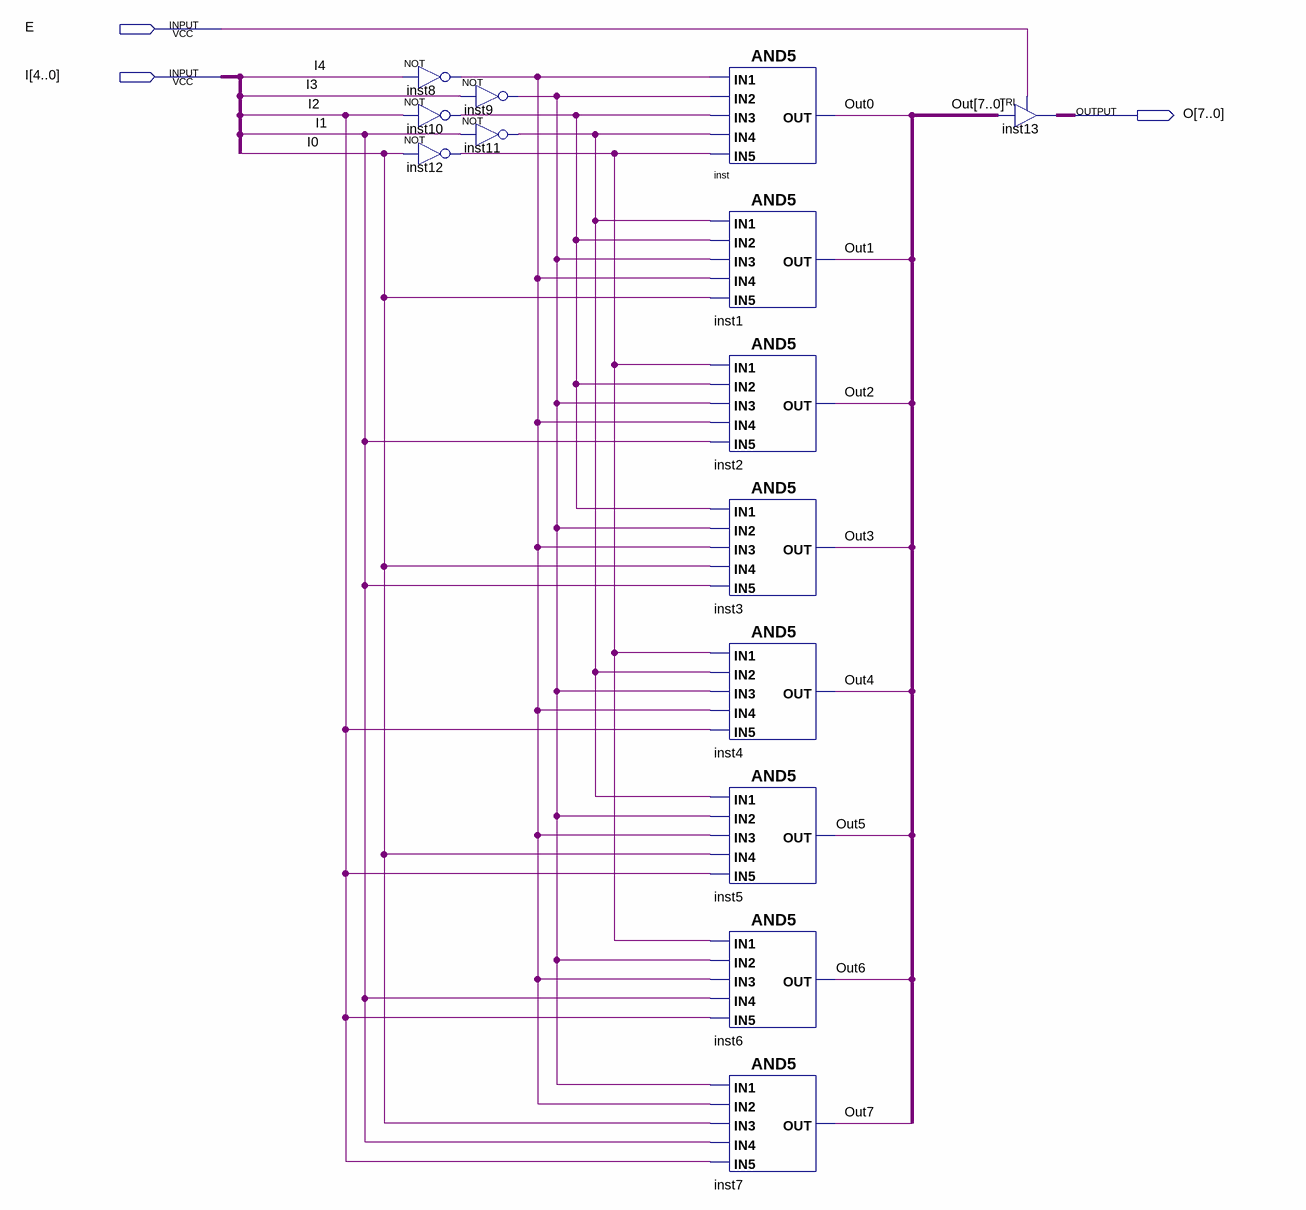
[diagram p0: schematic sheet]
// Quartus schematic decoder5to8.bdf as structural Verilog: 14 symbols, 3 pins
module decoder5to8 (
  input  E,
  input  [4:0] I,
  output [7:0] O
);

  wire inst8_out, inst9_out, inst10_out, inst11_out, inst12_out;
  wire [7:0] Out;

  not inst8 (inst8_out, I[4]);
  not inst10 (inst10_out, I[2]);
  not inst12 (inst12_out, I[0]);
  not inst9 (inst9_out, I[3]);
  not inst11 (inst11_out, I[1]);
  and inst (Out[0], inst8_out, inst9_out, inst10_out, inst11_out, inst12_out);
  and inst1 (Out[1], inst11_out, inst10_out, inst9_out, inst8_out, I[0]);
  and inst2 (Out[2], inst12_out, inst10_out, inst9_out, inst8_out, I[1]);
  and inst3 (Out[3], inst10_out, inst9_out, inst8_out, I[0], I[1]);
  and inst4 (Out[4], inst12_out, inst11_out, inst9_out, inst8_out, I[2]);
  and inst5 (Out[5], inst11_out, inst9_out, inst8_out, I[0], I[2]);
  and inst6 (Out[6], inst12_out, inst9_out, inst8_out, I[1], I[2]);
  and inst7 (Out[7], inst9_out, inst8_out, I[0], I[1], I[2]);
  TRI inst13[7:0] (.IN(Out), .OE(E), .OUT(O));
endmodule
